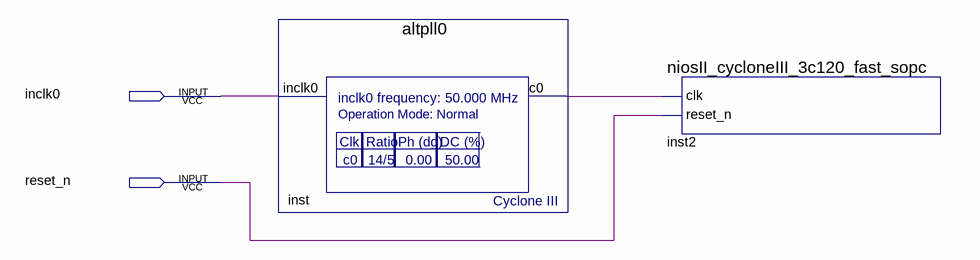
[diagram p0: schematic sheet]
// Quartus schematic niosII_cycloneIII_3c120_fast.bdf as structural Verilog: 2 symbols, 2 pins
module niosII_cycloneIII_3c120_fast (
  input  inclk0,
  input  reset_n
);

  wire inst_c0;

  altpll0 inst (.inclk0(inclk0), .c0(inst_c0));
  niosII_cycloneIII_3c120_fast_sopc inst2 (.clk(inst_c0), .reset_n(reset_n));
endmodule
